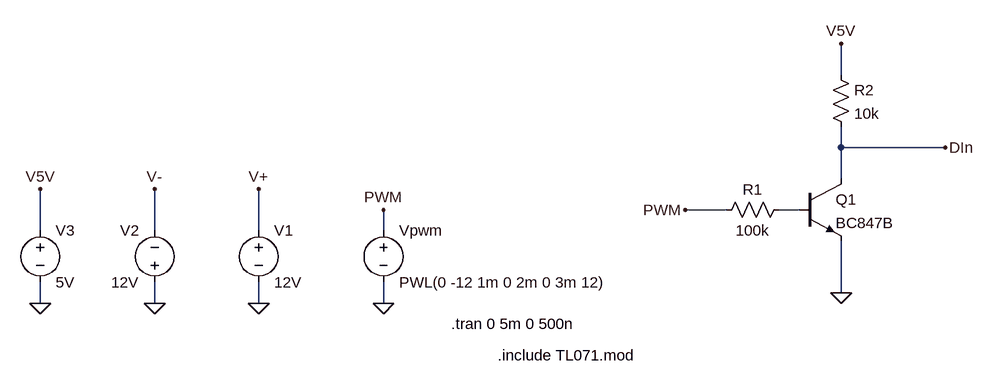
[diagram p0: schematic DigitalIO.asc]
DigitalIO.asc, the LTspice schematic file:
Version 4
SHEET 1 2248 680
WIRE 784 -112 784 -160
WIRE 784 0 784 -32
WIRE 944 0 784 0
WIRE 784 48 784 0
WIRE 608 96 544 96
WIRE 720 96 688 96
WIRE -448 128 -448 64
WIRE -272 128 -272 64
WIRE -112 128 -112 64
WIRE 80 128 80 96
WIRE 784 224 784 144
WIRE -448 240 -448 208
WIRE -272 240 -272 208
WIRE -112 240 -112 208
WIRE 80 240 80 208
FLAG 80 240 0
FLAG 80 96 PWM
FLAG 544 96 PWM
FLAG -112 240 0
FLAG -272 240 0
FLAG -448 240 0
FLAG -448 64 V5V
FLAG -272 64 V-
FLAG -112 64 V+
FLAG 784 224 0
FLAG 784 -160 V5V
FLAG 944 0 DIn
SYMBOL voltage 80 112 R0
WINDOW 123 0 0 Left 2
WINDOW 39 0 0 Left 2
SYMATTR InstName Vpwm
SYMATTR Value PWL(0 -12 1m 0 2m 0 3m 12)
SYMBOL res 704 80 R90
WINDOW 0 0 56 VBottom 2
WINDOW 3 32 56 VTop 2
SYMATTR InstName R1
SYMATTR Value 100k
SYMBOL /voltage -112 112 R0
SYMATTR InstName V1
SYMATTR Value 12V
SYMBOL /voltage -272 224 R180
WINDOW 0 24 96 Left 2
WINDOW 3 24 16 Left 2
SYMATTR InstName V2
SYMATTR Value 12V
SYMBOL /voltage -448 112 R0
SYMATTR InstName V3
SYMATTR Value 5V
SYMBOL /npn 720 48 R0
SYMATTR InstName Q1
SYMATTR Value BC847B
SYMBOL /res 768 -128 R0
SYMATTR InstName R2
SYMATTR Value 10k
TEXT 184 272 Left 2 !.tran 0 5m 0 500n
TEXT 256 320 Left 2 !.include TL071.mod

The netlist it stands for:
* DigitalIO.asc
Vpwm PWM 0 PWL(0 -12 1m 0 2m 0 3m 12)
R1 N001 PWM 100k
V1 V+ 0 12V
V2 0 V- 12V
V3 V5V 0 5V
Q1 DIn N001 0 0 BC847B
R2 V5V DIn 10k
.model NPN NPN
.model PNP PNP
.lib standard.bjt
.tran 0 5m 0 500n
.include TL071.mod
.backanno
.end